# Altium schematic sheet SD.SchDoc
size A4; DocumentNumber: 18; SheetNumber: ALT0056; SheetTotal: 21
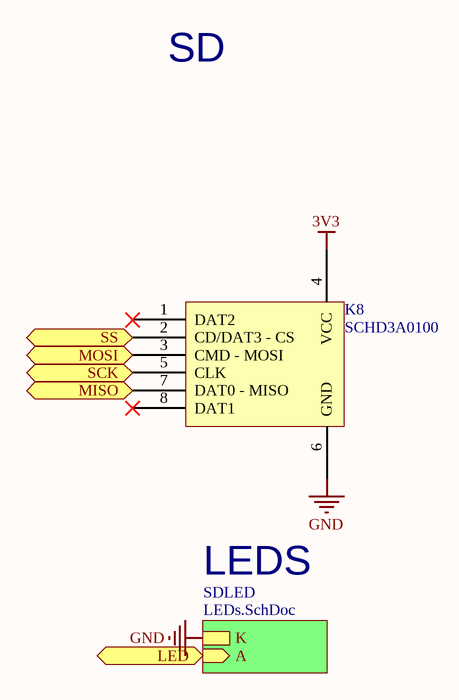
[diagram p0: SD.SchDoc]

## Parts
K8  SCHD3A0100  [SCHD3A0100]

## Sub-sheets
SDLED = LEDs.SchDoc: K, A (in)

## Ports
LED (in), MISO (out), MOSI (in), SCK (in), SS (in)

## Nets
3V3: K8.4(VCC)
GND: K8.6(GND) ; sheet SDLED/K
LED: port LED, sheet SDLED/A
MISO: K8.7(DAT0_-_MISO) ; port MISO
MOSI: K8.3(CMD_-_MOSI) ; port MOSI
SCK: K8.5(CLK) ; port SCK
SS: K8.2(CD/DAT3_-_CS) ; port SS

Not connected (* = marked no-connect by the designer): K8 1(DAT2)* 8(DAT1)*

## Notes on the sheet
- SD
- LEDS
- Title
- Size:
- Date:
- A4
- Number:
- Time:
- Revision:
- Sheet
- of
- File: